# Altium schematic sheet SENSORS.SchDoc
size 386 x 246 mm
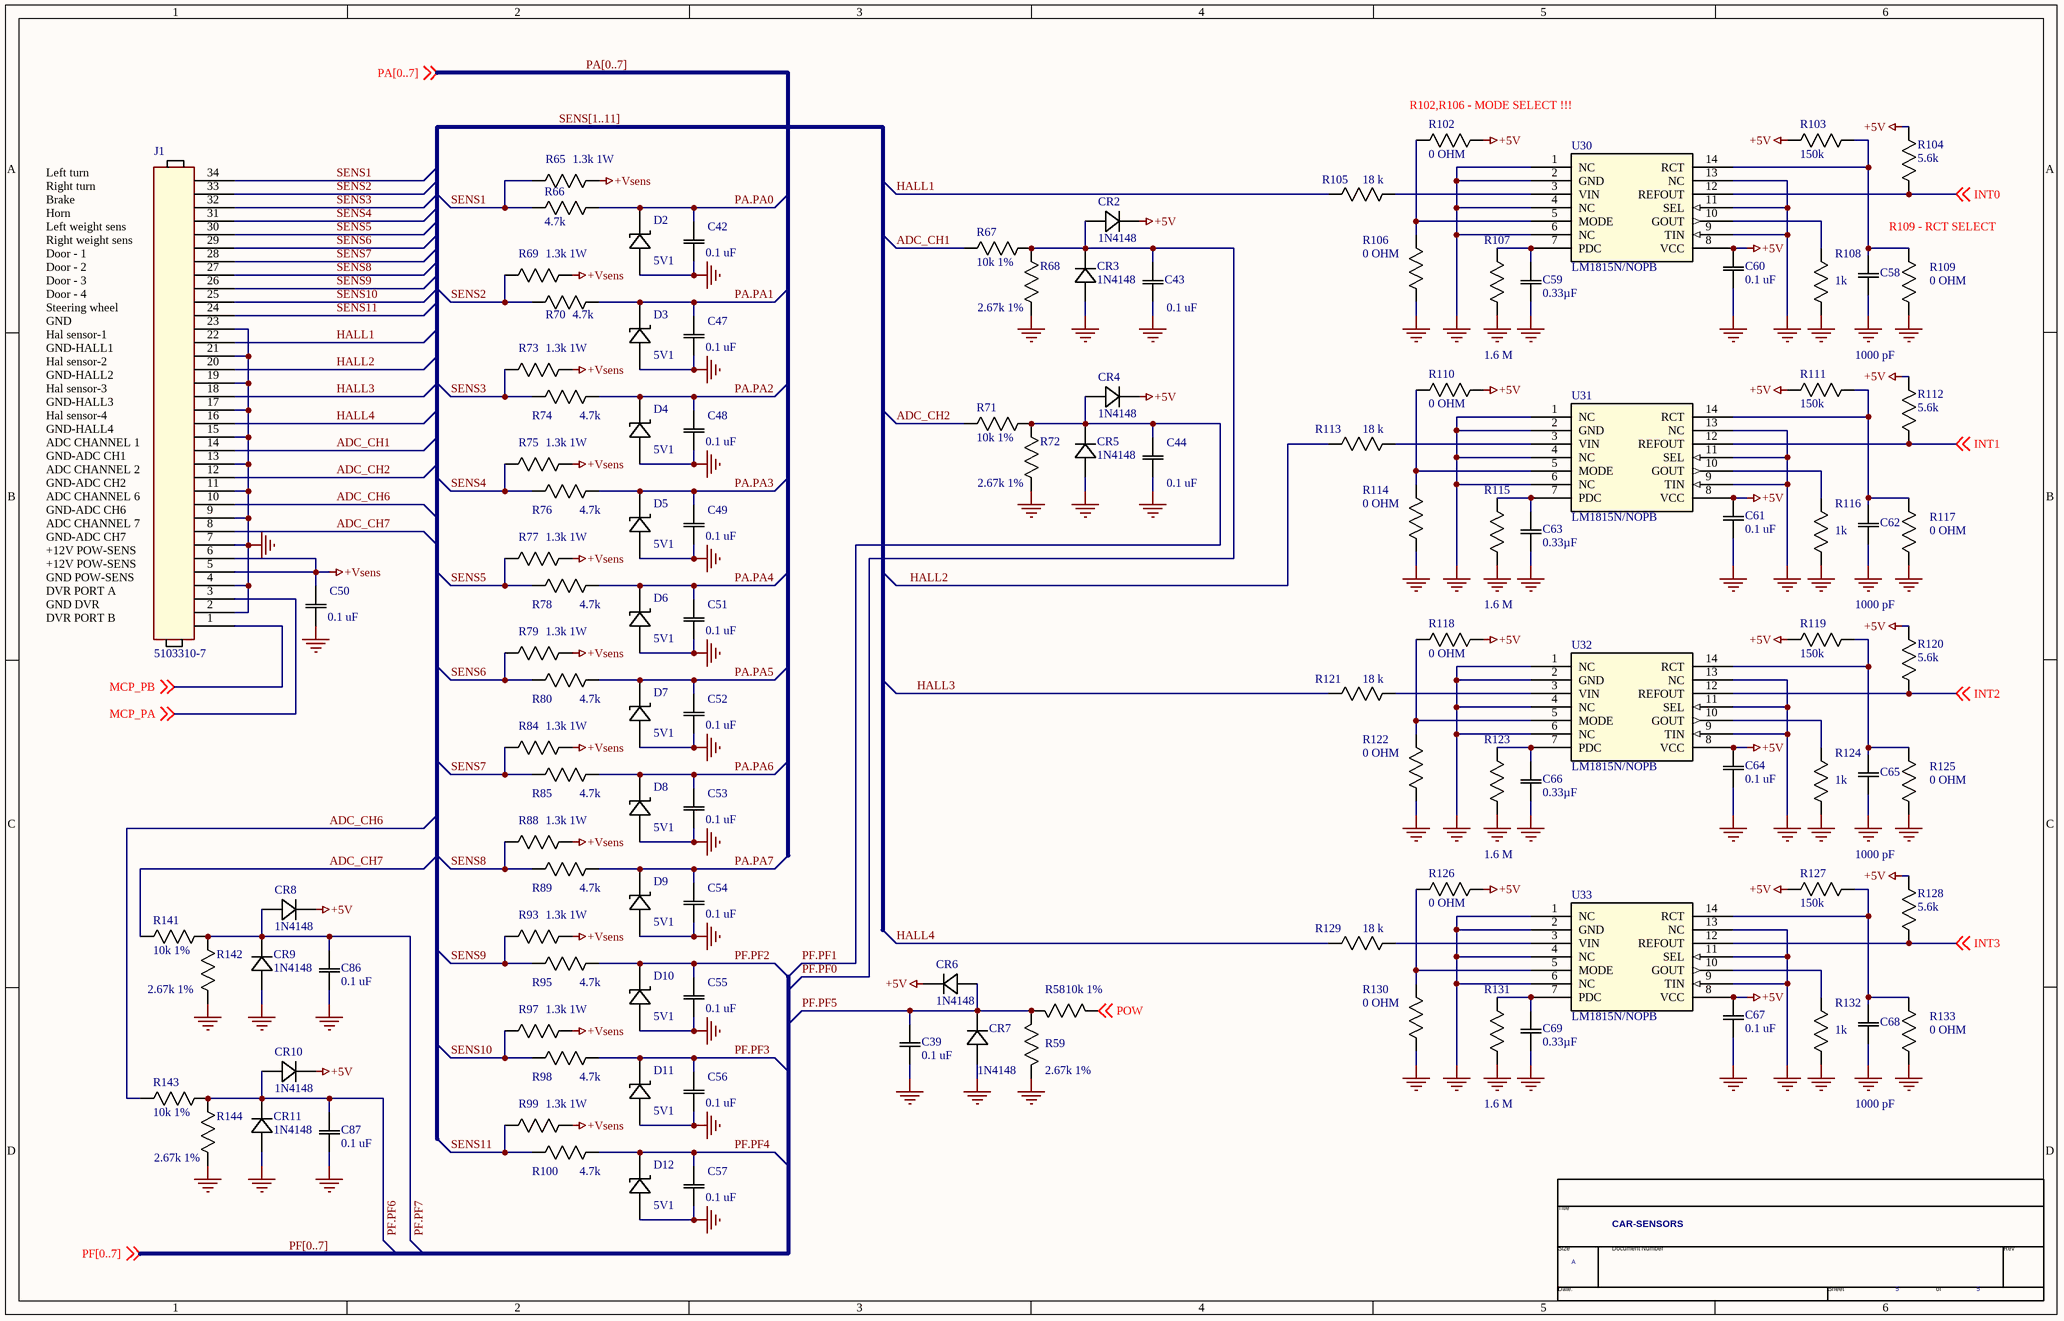
[diagram p0: SENSORS.SchDoc]

## Parts
*  Page Count: 5  Page Size: A  Title: CAR-SENSORS  (hidden comment: TitleBlock0)  (graphical)
C39  0.1 uF  [SR20]
C42  0.1 uF  [SR20]
C43  0.1 uF  [SR20]
C44  0.1 uF  [SR20]
C47  0.1 uF  [SR20]
C48  0.1 uF  [SR20]
C49  0.1 uF  [SR20]
C50  0.1 uF  [SR20]
C51  0.1 uF  [SR20]
C52  0.1 uF  [SR20]
C53  0.1 uF  [SR20]
C54  0.1 uF  [SR20]
C55  0.1 uF  [SR20]
C56  0.1 uF  [SR20]
C57  0.1 uF  [SR20]
C58  1000 pF  [SR20]
C59  0.33µF  [SR20]
C60  0.1 uF  [SR20]
C61  0.1 uF  [SR20]
C62  1000 pF  [SR20]
C63  0.33µF  [SR20]
C64  0.1 uF  [SR20]
C65  1000 pF  [SR20]
C66  0.33µF  [SR20]
C67  0.1 uF  [SR20]
C68  1000 pF  [SR20]
C69  0.33µF  [SR20]
C86  0.1 uF  [SR20]
C87  0.1 uF  [SR20]
CR2  1N4148  [DO35]
CR3  1N4148  [DO35]
CR4  1N4148  [DO35]
CR5  1N4148  [DO35]
CR6  1N4148  [DO35]
CR7  1N4148  [DO35]
CR8  1N4148  [DO35]
CR9  1N4148  [DO35]
CR10  1N4148  [DO35]
CR11  1N4148  [DO35]
D2  5V1  [DO35]
D3  5V1  [DO35]
D4  5V1  [DO35]
D5  5V1  [DO35]
D6  5V1  [DO35]
D7  5V1  [DO35]
D8  5V1  [DO35]
D9  5V1  [DO35]
D10  5V1  [DO35]
D11  5V1  [DO35]
D12  5V1  [DO35]
J1  5103310-7  [*TYCO_5103310-7]
R58  10k 1%  [RES AXIAL 1/6W]
R59  2.67k 1%  [YAG_MF25]
R65  1.3k 1W  [YAG_FMP100]
R66  4.7k  [RES AXIAL 1/6W]
R67  10k 1%  [RES AXIAL 1/6W]
R68  2.67k 1%  [YAG_MF25]
R69  1.3k 1W  [YAG_FMP100]
R70  4.7k  [RES AXIAL 1/6W]
R71  10k 1%  [RES AXIAL 1/6W]
R72  2.67k 1%  [YAG_MF25]
R73  1.3k 1W  [YAG_FMP100]
R74  4.7k  [RES AXIAL 1/6W]
R75  1.3k 1W  [YAG_FMP100]
R76  4.7k  [RES AXIAL 1/6W]
R77  1.3k 1W  [YAG_FMP100]
R78  4.7k  [RES AXIAL 1/6W]
R79  1.3k 1W  [YAG_FMP100]
R80  4.7k  [RES AXIAL 1/6W]
R84  1.3k 1W  [YAG_FMP100]
R85  4.7k  [RES AXIAL 1/6W]
R88  1.3k 1W  [YAG_FMP100]
R89  4.7k  [RES AXIAL 1/6W]
R93  1.3k 1W  [YAG_FMP100]
R95  4.7k  [RES AXIAL 1/6W]
R97  1.3k 1W  [YAG_FMP100]
R98  4.7k  [RES AXIAL 1/6W]
R99  1.3k 1W  [YAG_FMP100]
R100  4.7k  [RES AXIAL 1/6W]
R102  0 OHM  [RES AXIAL 1/6W]
R103  150k  [RES AXIAL 1/6W]
R104  5.6k  [RES AXIAL 1/6W]
R105  18 k  [RES AXIAL 1/6W]
R106  0 OHM  [RES AXIAL 1/6W]
R107  1.6 M  [RES AXIAL 1/6W]
R108  1k  [RES AXIAL 1/6W]
R109  0 OHM  [RES AXIAL 1/6W]
R110  0 OHM  [RES AXIAL 1/6W]
R111  150k  [RES AXIAL 1/6W]
R112  5.6k  [RES AXIAL 1/6W]
R113  18 k  [RES AXIAL 1/6W]
R114  0 OHM  [RES AXIAL 1/6W]
R115  1.6 M  [RES AXIAL 1/6W]
R116  1k  [RES AXIAL 1/6W]
R117  0 OHM  [RES AXIAL 1/6W]
R118  0 OHM  [RES AXIAL 1/6W]
R119  150k  [RES AXIAL 1/6W]
R120  5.6k  [RES AXIAL 1/6W]
R121  18 k  [RES AXIAL 1/6W]
R122  0 OHM  [RES AXIAL 1/6W]
R123  1.6 M  [RES AXIAL 1/6W]
R124  1k  [RES AXIAL 1/6W]
R125  0 OHM  [RES AXIAL 1/6W]
R126  0 OHM  [RES AXIAL 1/6W]
R127  150k  [RES AXIAL 1/6W]
R128  5.6k  [RES AXIAL 1/6W]
R129  18 k  [RES AXIAL 1/6W]
R130  0 OHM  [RES AXIAL 1/6W]
R131  1.6 M  [RES AXIAL 1/6W]
R132  1k  [RES AXIAL 1/6W]
R133  0 OHM  [RES AXIAL 1/6W]
R141  10k 1%  [RES AXIAL 1/6W]
R142  2.67k 1%  [YAG_MF25]
R143  10k 1%  [RES AXIAL 1/6W]
R144  2.67k 1%  [YAG_MF25]
U30  LM1815N/NOPB  [PDIP14_300MC]
U31  LM1815N/NOPB  [PDIP14_300MC]
U32  LM1815N/NOPB  [PDIP14_300MC]
U33  LM1815N/NOPB  [PDIP14_300MC]

## Nets
+5V: C60.2 C61.2 C64.2 C67.2 CR2.C CR4.C CR6.C CR8.C CR10.C R102.2 R103.1 R104.1 R110.2 R111.1 R112.1 R118.2 R119.1 R120.1 R126.2 R127.1 R128.1 U30.8(VCC) U31.8(VCC) U32.8(VCC) U33.8(VCC)
+Vsens: C50.2 J1.5 J1.6 R65.1 R69.1 R73.1 R75.1 R77.1 R79.1 R84.1 R88.1 R93.1 R97.1 R99.1
GND: C39.1 C42.1 C43.1 C44.1 C47.1 C48.1 C49.1 C50.1 C51.1 C52.1 C53.1 C54.1 C55.1 C56.1 C57.1 C58.1 C59.1 C60.1 C61.1 C62.1 C63.1 C64.1 C65.1 C66.1 C67.1 C68.1 C69.1 C86.1 C87.1 CR3.A CR5.A CR7.A CR9.A CR11.A D2.A D3.A D4.A D5.A D6.A D7.A D8.A D9.A D10.A D11.A D12.A J1.2 J1.4 J1.7 J1.9 J1.11 J1.13 J1.15 J1.17 J1.19 J1.21 J1.23 R59.1 R68.1 R72.1 R106.1 R107.2 R108.1 R109.1 R114.1 R115.2 R116.1 R117.1 R122.1 R123.2 R124.1 R125.1 R130.1 R131.2 R132.1 R133.1 R142.1 R144.1 U30.1(NC) U30.2(GND) U30.4(NC) U30.6(NC) U30.9(TIN) U30.11(SEL) U30.13(NC) U31.1(NC) U31.2(GND) U31.4(NC) U31.6(NC) U31.9(TIN) U31.11(SEL) U31.13(NC) U32.1(NC) U32.2(GND) U32.4(NC) U32.6(NC) U32.9(TIN) U32.11(SEL) U32.13(NC) U33.1(NC) U33.2(GND) U33.4(NC) U33.6(NC) U33.9(TIN) U33.11(SEL) U33.13(NC)
ADC_CH1: J1.14 R67.1
ADC_CH2: J1.12 R71.1
ADC_CH6: J1.10 R143.1
ADC_CH7: J1.8 R141.1
HALL1: J1.22 R105.2
HALL2: J1.20 R113.2
HALL3: J1.18 R121.2
HALL4: J1.16 R129.2
INT0: R104.2 U30.12(REFOUT) ; off-sheet INT0
INT1: R112.2 U31.12(REFOUT) ; off-sheet INT1
INT2: R120.2 U32.12(REFOUT) ; off-sheet INT2
INT3: R128.2 U33.12(REFOUT) ; off-sheet INT3
MCP_PA: J1.3 ; off-sheet MCP_PA
MCP_PB: J1.1 ; off-sheet MCP_PB
PA.PA0: C42.2 D2.C R66.1
PA.PA1: C47.2 D3.C R70.1
PA.PA2: C48.2 D4.C R74.1
PA.PA3: C49.2 D5.C R76.1
PA.PA4: C51.2 D6.C R78.1
PA.PA5: C52.2 D7.C R80.1
PA.PA6: C53.2 D8.C R85.1
PA.PA7: C54.2 D9.C R89.1
PF.PF0: C43.2 CR2.A CR3.C R67.2 R68.2
PF.PF1: C44.2 CR4.A CR5.C R71.2 R72.2
PF.PF2: C55.2 D10.C R95.1
PF.PF3: C56.2 D11.C R98.1
PF.PF4: C57.2 D12.C R100.1
PF.PF5: C39.2 CR6.A CR7.C R58.2 R59.2
PF.PF6: C87.2 CR10.A CR11.C R143.2 R144.2
PF.PF7: C86.2 CR8.A CR9.C R141.2 R142.2
POW: R58.1 ; off-sheet POW
SENS1: J1.34 R65.2 R66.2
SENS2: J1.33 R69.2 R70.2
SENS3: J1.32 R73.2 R74.2
SENS4: J1.31 R75.2 R76.2
SENS5: J1.30 R77.2 R78.2
SENS6: J1.29 R79.2 R80.2
SENS7: J1.28 R84.2 R85.2
SENS8: J1.27 R88.2 R89.2
SENS9: J1.26 R93.2 R95.2
SENS10: J1.25 R97.2 R98.2
SENS11: J1.24 R99.2 R100.2
NetC58_2: C58.2 R103.2 R109.2 U30.14(RCT)
NetC59_2: C59.2 R107.1 U30.7(PDC)
NetC62_2: C62.2 R111.2 R117.2 U31.14(RCT)
NetC63_2: C63.2 R115.1 U31.7(PDC)
NetC65_2: C65.2 R119.2 R125.2 U32.14(RCT)
NetC66_2: C66.2 R123.1 U32.7(PDC)
NetC68_2: C68.2 R127.2 R133.2 U33.14(RCT)
NetC69_2: C69.2 R131.1 U33.7(PDC)
NetR102_1: R102.1 R106.2 U30.5(MODE)
NetR105_1: R105.1 U30.3(VIN)
NetR108_2: R108.2 U30.10(GOUT)
NetR110_1: R110.1 R114.2 U31.5(MODE)
NetR113_1: R113.1 U31.3(VIN)
NetR116_2: R116.2 U31.10(GOUT)
NetR118_1: R118.1 R122.2 U32.5(MODE)
NetR121_1: R121.1 U32.3(VIN)
NetR124_2: R124.2 U32.10(GOUT)
NetR126_1: R126.1 R130.2 U33.5(MODE)
NetR129_1: R129.1 U33.3(VIN)
NetR132_2: R132.2 U33.10(GOUT)

## Buses and harness runs
bus PA[0..7]
bus PF[0..7]
bus SENS[1..11]

## Notes on the sheet
- (near R102) R102,R106 - MODE SELECT !!!
- Left turn
- Right turn
- Brake
- Horn
- (near J1) Left weight sens
- (near J1) Right weight sens
- Door - 1
- R109 - RCT SELECT
- Door - 2
- Door - 3
- Door - 4
- Steering wheel
- GND
- Hal sensor-1
- GND-HALL1
- Hal sensor-2
- GND-HALL2
- Hal sensor-3
- GND-HALL3
- Hal sensor-4
- GND-HALL4
- ADC CHANNEL 1
- GND-ADC CH1
- GND-ADC CH2
- ADC CHANNEL 2
- GND-ADC CH6
- ADC CHANNEL 6
- ADC CHANNEL 7
- GND POW-SENS
- +12V POW-SENS
- GND-ADC CH7
- DVR PORT A
- GND DVR
- DVR PORT B
- (in symbol TitleBlock0) Title; Size; Document Number; Rev; Date:; Sheet; of

## Library data of the parts
C39 C42-C44 C47-C57 C60 C61 C64 C67 C86 C87 = CAP RADIAL 2.54: 0.1µF ±10% 100V Ceramic Capacitor X7R Radial; Manufacturer_Part_Number: C320C104K1R5TA7301; Vendor: KEMET; Type: DEV; RefDes: RefDes; Value: 0.1 uF
C58 C62 C65 C68 = CAP RADIAL 2.54: CAP CER 1000PF 50V X7R RADIAL; Manufacturer_Part_Number: C315C102K5R5TA7301; Vendor: KEMET; Type: DEV; RefDes: RefDes; Value: 1000 pF
C59 C63 C66 C69 = CAP RADIAL 2.54: CAP CER 0.33UF 50V X8R RADIAL; Manufacturer_Part_Number: AR205F334K4R; Vendor: AVX Corporation; Type: DEV; RefDes: RefDes; Value: 0.33µF
CR2-CR11 = 1N4148: Imported; Vendor: Nexperia; Type: DEV; C: Copyright (C) 2015 Accelerated Designs. All rights reserved; Manufacturer_Part_Number: 1N4148; Copyright: Copyright (C) 2016 Accelerated Designs. All rights reserved; RefDes: RefDes; Value: Value
D2-D12 = ZENNER DO-35: DIODE ZENER 5.1V 500MW DO35; Manufacturer_Part_Number: 1N5231B; Vendor: ON Semiconductor; Value: 5V1
J1 = 5103310-7: A/L LOW PRO HDR 34P RA BLACK
R58 R67 R71 R141 R143 = Resistor Axial  1/6W: RES 10K OHM 1/8W 1% AXIAL; Manufacturer_Part_Number: RNF18FTD10K0; Vendor: Stackpole Electronics Inc.; RefDes: RefDes; Type: DEV; Value: 10k 1%
R59 R68 R72 R142 R144 = Resistor Axial  1/4W: RES 2.67K OHM 1/4W 1% AXIAL; Manufacturer_Part_Number: MFR-25FBF52-2K67; Vendor: *; RefDes: RefDes; Type: DEV; Value: 2.67k 1%
R65 R69 R73 R75 R77 R79 R84 R88 R93 R97 R99 = Resistor Axial  1W: RES 1.3K OHM 1W 5% AXIAL; Manufacturer_Part_Number: RSF100JB-73-1K3; Vendor: Yageo; RefDes: RefDes; Type: DEV; Value: 1.3k 1W
R66 R70 R74 R76 R78 R80 R85 R89 R95 R98 R100 = Resistor Axial  1/6W: RES 4.7K OHM 1/6W 5% AXIAL; Manufacturer_Part_Number: CFR-12JB-52-4K7; Vendor: Yageo; RefDes: RefDes; Type: DEV; Value: 4.7k
R102 R106 R109 R110 R114 R117 R118 R122 R125 R126 R130 R133 = Resistor Axial  1/6W: RES 0 OHM 1/6W JUMP AXIAL; Manufacturer_Part_Number: ZOR-12-B-52-0R; Vendor: Yageo; RefDes: RefDes; Type: DEV; Value: 0 OHM
R103 R111 R119 R127 = Resistor Axial  1/6W: RES 150K OHM 1/6W 5% AXIAL; Manufacturer_Part_Number: CFR-12JB-52-150K; Vendor: Yageo; RefDes: RefDes; Type: DEV; Value: 150k
R104 R112 R120 R128 = Resistor Axial  1/6W: RES 5.6K OHM 1/6W 5% AXIAL; Manufacturer_Part_Number: CFR-12JB-52-5K6; Vendor: Yageo; RefDes: RefDes; Type: DEV; Value: 5.6k
R105 R113 R121 R129 = Resistor Axial  1/6W: RES 18K OHM 1/6W 5% AXIAL; Manufacturer_Part_Number: CFR-12JB-52-18K; Vendor: Yageo; RefDes: RefDes; Type: DEV; Value: 18 k
R107 R115 R123 R131 = Resistor Axial  1/6W: RES 1.6M OHM 1/6W 5% AXIAL; Manufacturer_Part_Number: CFR-12JB-52-1M6; Vendor: Yageo; RefDes: RefDes; Type: DEV; Value: 1.6 M
R108 R116 R124 R132 = Resistor Axial  1/6W: RES 1K OHM 1/6W 5% AXIAL; Manufacturer_Part_Number: CFR-12JB-52-1K; Vendor: Yageo; RefDes: RefDes; Type: DEV; Value: 1k
U30-U33 = LM1815N/NOPB: IC AMP ADAPTIVE SENSOR 14-DIP; Built_By: EMA_UL_Team; C: Copyright (C) 2015 Accelerated Designs. All rights reserved; Manufacturer_Part_Number: LM1815N/NOPB; RefDes: RefDes; Type: DEV; Value: LM1815N/NOPB
* = TitleBlock0: Page Number: 5; Page Create Date: March  8, 1995